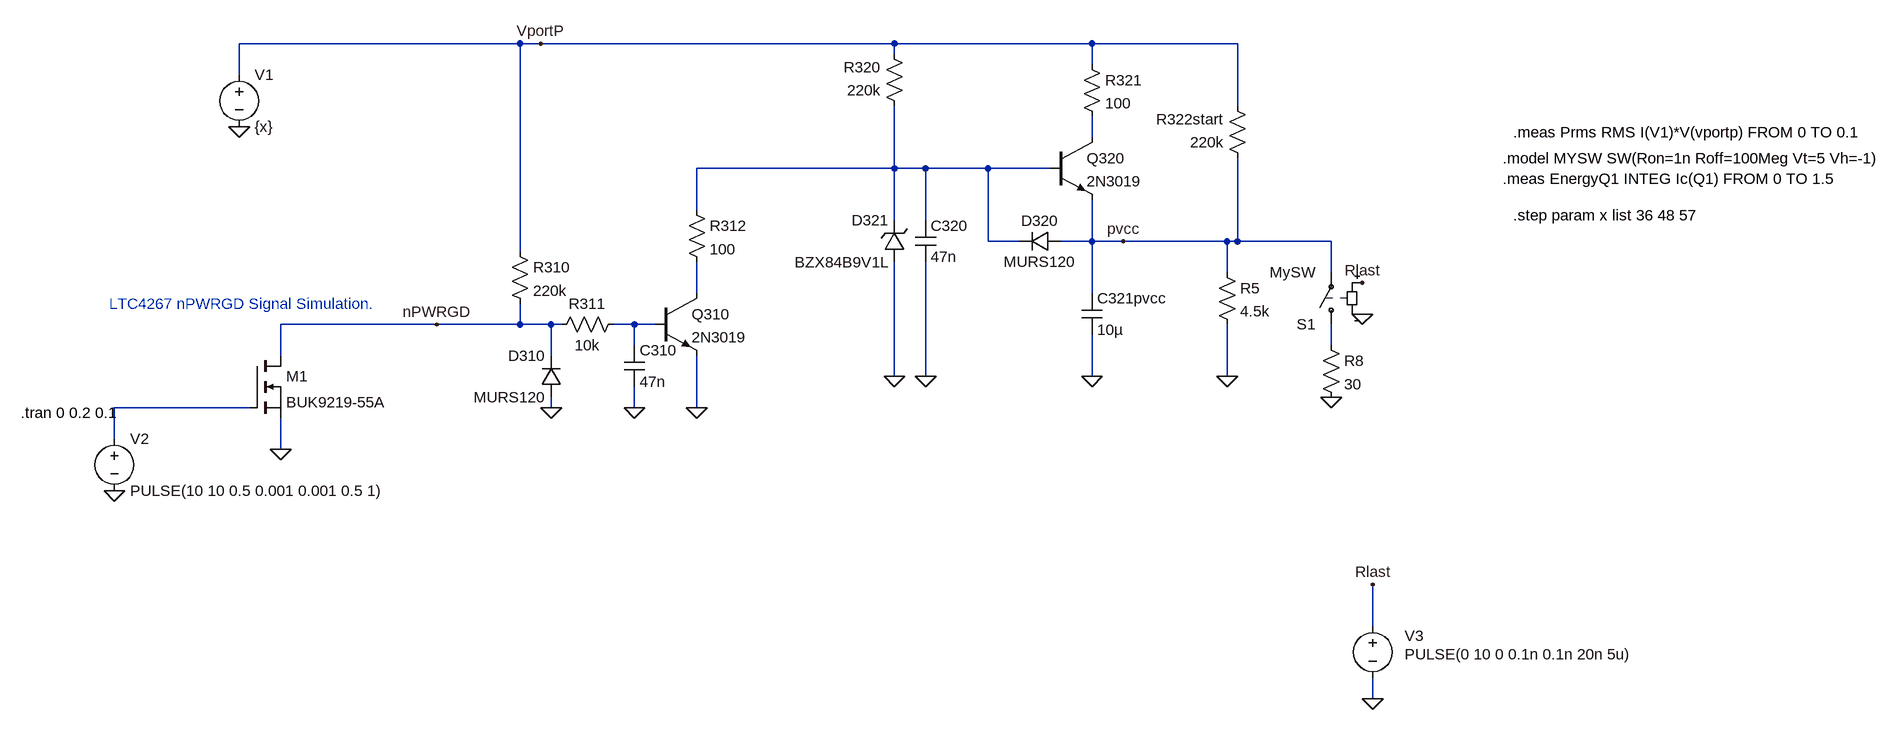
[diagram p0: schematic EinAusschaltLogik.asc]
EinAusschaltLogik.asc, the LTspice schematic file:
Version 4
SHEET 1 2056 680
WIRE -208 -352 -640 -352
WIRE -176 -352 -208 -352
WIRE 368 -352 -176 -352
WIRE 672 -352 368 -352
WIRE 896 -352 672 -352
WIRE 368 -336 368 -352
WIRE 672 -320 672 -352
WIRE -640 -304 -640 -352
WIRE 896 -256 896 -352
WIRE 672 -208 672 -240
WIRE 368 -160 368 -256
WIRE 368 -160 64 -160
WIRE 416 -160 368 -160
WIRE 512 -160 416 -160
WIRE 608 -160 512 -160
WIRE 64 -96 64 -160
WIRE 368 -80 368 -160
WIRE 416 -80 416 -160
WIRE 512 -48 512 -160
WIRE 560 -48 512 -48
WIRE 672 -48 672 -112
WIRE 672 -48 624 -48
WIRE 720 -48 672 -48
WIRE 880 -48 720 -48
WIRE 896 -48 896 -176
WIRE 896 -48 880 -48
WIRE 1040 -48 896 -48
WIRE -208 -32 -208 -352
WIRE 880 0 880 -48
WIRE 1040 0 1040 -48
WIRE 64 32 64 -16
WIRE 672 32 672 -48
WIRE -336 80 -576 80
WIRE -208 80 -208 48
WIRE -208 80 -336 80
WIRE -160 80 -208 80
WIRE -144 80 -160 80
WIRE -32 80 -64 80
WIRE 0 80 -32 80
WIRE -32 112 -32 80
WIRE 1040 112 1040 80
WIRE -576 128 -576 80
WIRE -160 128 -160 80
WIRE 368 160 368 -16
WIRE 416 160 416 -16
WIRE 672 160 672 96
WIRE 880 160 880 80
WIRE -624 208 -832 208
WIRE -160 208 -160 192
WIRE -32 208 -32 176
WIRE 64 208 64 128
WIRE -832 256 -832 208
WIRE -576 272 -576 224
WIRE 1104 544 1104 480
WIRE 1104 656 1104 624
FLAG 368 160 0
FLAG 672 160 0
FLAG 64 208 0
FLAG 720 -48 pvcc
FLAG -336 80 nPWRGD
FLAG -176 -352 VportP
FLAG -640 -224 0
FLAG -832 336 0
FLAG 880 160 0
FLAG -576 272 0
FLAG -32 208 0
FLAG 1088 64 0
FLAG 1104 656 0
FLAG 1104 480 Rlast
FLAG 1088 16 Rlast
FLAG 1040 192 0
FLAG -160 208 0
FLAG 416 160 0
SYMBOL res -224 -48 R0
SYMATTR InstName R310
SYMATTR Value 220k
SYMBOL res -48 64 R90
WINDOW 0 0 56 VBottom 2
WINDOW 3 32 56 VTop 2
SYMATTR InstName R311
SYMATTR Value 10k
SYMBOL res 384 -240 R180
WINDOW 0 36 76 Left 2
WINDOW 3 36 40 Left 2
SYMATTR InstName R320
SYMATTR Value 220k
SYMBOL res 912 -160 R180
WINDOW 0 36 76 Left 2
WINDOW 3 36 40 Left 2
SYMATTR InstName R322start
SYMATTR Value 220k
SYMBOL npn 0 32 R0
SYMATTR InstName Q310
SYMATTR Value 2N3019
SYMBOL npn 608 -208 R0
SYMATTR InstName Q320
SYMATTR Value 2N3019
SYMBOL zener 384 -16 R180
WINDOW 0 24 64 Left 2
WINDOW 3 24 0 Left 2
SYMATTR InstName D321
SYMATTR Value BZX84B9V1L
SYMBOL cap 656 32 R0
SYMATTR InstName C321pvcc
SYMATTR Value 10µ
SYMBOL voltage -640 -320 R0
WINDOW 123 0 0 Left 0
WINDOW 39 0 0 Left 0
SYMATTR InstName V1
SYMATTR Value {x}
SYMBOL voltage -832 240 R0
WINDOW 123 0 0 Left 0
WINDOW 39 0 0 Left 0
SYMATTR InstName V2
SYMATTR Value PULSE(10 10 0.5 0.001 0.001 0.5 1)
SYMBOL res 864 -16 R0
SYMATTR InstName R5
SYMATTR Value 4.5k
SYMBOL res 656 -336 R0
SYMATTR InstName R321
SYMATTR Value 100
SYMBOL diode 624 -64 R90
WINDOW 0 0 32 VBottom 2
WINDOW 3 32 32 VTop 2
SYMATTR InstName D320
SYMATTR Value MURS120
SYMBOL nmos -624 128 R0
SYMATTR InstName M1
SYMATTR Value BUK9219-55A
SYMBOL cap -48 112 R0
SYMATTR InstName C310
SYMATTR Value 47n
SYMBOL cap 400 -80 R0
SYMATTR InstName C320
SYMATTR Value 47n
SYMBOL res 48 -112 R0
SYMATTR InstName R312
SYMATTR Value 100
SYMBOL sw 1040 96 R180
SYMATTR InstName S1
SYMATTR Value MySW
SYMBOL voltage 1104 528 R0
WINDOW 0 49 31 Left 2
WINDOW 3 49 59 Left 2
WINDOW 123 0 0 Left 2
WINDOW 39 0 0 Left 2
SYMATTR InstName V3
SYMATTR Value PULSE(0 10 0 0.1n 0.1n 20n 5u)
SYMBOL res 1024 96 R0
SYMATTR InstName R8
SYMATTR Value 30
SYMBOL diode -144 192 R180
WINDOW 0 24 64 Left 2
WINDOW 3 24 0 Left 2
SYMATTR InstName D310
SYMATTR Value MURS120
TEXT -976 216 Left 2 !.tran 0 0.2 0.1
TEXT 1304 -144 Left 2 !.meas EnergyQ1 INTEG Ic(Q1) FROM 0 TO 1.5
TEXT -840 48 Left 2 ;LTC4267 nPWRGD Signal Simulation.
TEXT 1320 -88 Left 2 !.step param x list 36 48 57
TEXT 1304 -176 Left 2 !.model MYSW SW(Ron=1n Roff=100Meg Vt=5 Vh=-1)
TEXT 1320 -216 Left 2 !.meas Prms RMS I(V1)*V(vportp) FROM 0 TO 0.1

The netlist it stands for:
* EinAusschaltLogik.asc
R310 VportP nPWRGD 220k
R311 N004 nPWRGD 10k
R320 N002 VportP 220k
R322start pvcc VportP 220k
Q310 N003 N004 0 0 2N3019
Q320 N001 N002 pvcc 0 2N3019
D321 0 N002 BZX84B9V1L
C321pvcc pvcc 0 10µ
V1 VportP 0 {x}
V2 N006 0 PULSE(10 10 0.5 0.001 0.001 0.5 1)
R5 pvcc 0 4.5k
R321 VportP N001 100
D320 pvcc N002 MURS120
M1 nPWRGD N006 0 0 BUK9219-55A
C310 N004 0 47n
C320 N002 0 47n
R312 N002 N003 100
S1 N005 pvcc Rlast 0 MySW
V3 Rlast 0 PULSE(0 10 0 0.1n 0.1n 20n 5u)
R8 N005 0 30
D310 0 nPWRGD MURS120
.model D D
.lib standard.dio
.model NPN NPN
.model PNP PNP
.lib standard.bjt
.model NMOS NMOS
.model PMOS PMOS
.lib standard.mos
.tran 0 0.2 0.1
.meas EnergyQ1 INTEG Ic(Q1) FROM 0 TO 1.5
* LTC4267 nPWRGD Signal Simulation.
.step param x list 36 48 57
.model MYSW SW(Ron=1n Roff=100Meg Vt=5 Vh=-1)
.meas Prms RMS I(V1)*V(vportp) FROM 0 TO 0.1
.backanno
.end